# Altium schematic sheet HEATER.SchDoc: HEATER
size 420 x 297 mm; SheetNumber: 7; SheetTotal: 11
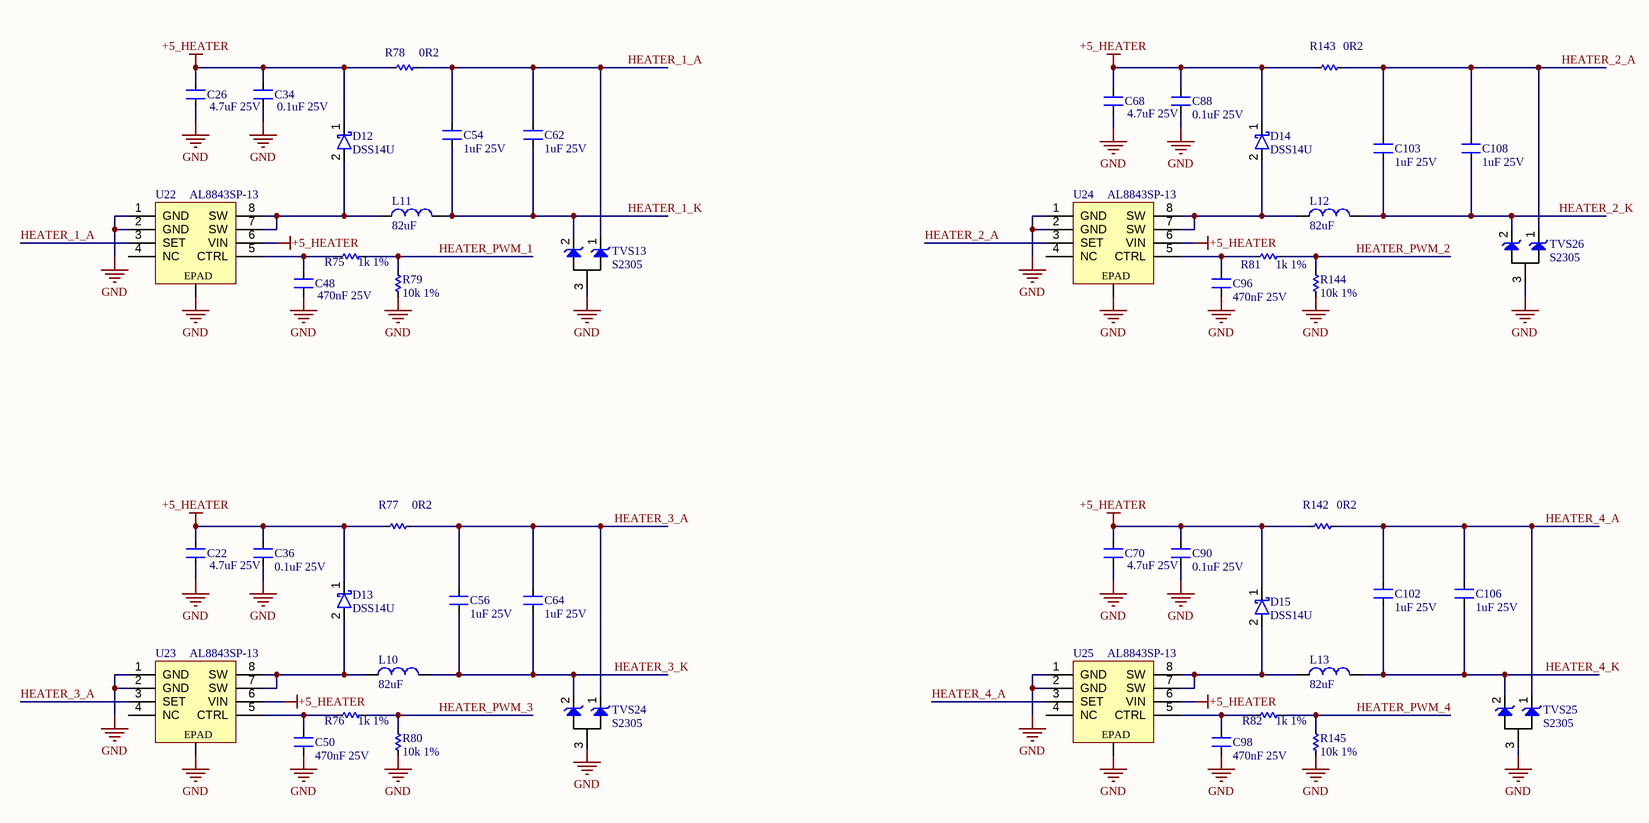
[diagram p0: HEATER.SchDoc]

## Parts
C22  4.7uF 25V  [CN-SMD-0603]
C26  4.7uF 25V  [CN-SMD-0603]
C34  0.1uF 25V  [CN-SMD-0603]
C36  0.1uF 25V  [CN-SMD-0603]
C48  470nF 25V  [CN-SMD-0603]
C50  470nF 25V  [CN-SMD-0603]
C54  1uF 25V  [CN-SMD-0603]
C56  1uF 25V  [CN-SMD-0603]
C62  1uF 25V  [CN-SMD-0603]
C64  1uF 25V  [CN-SMD-0603]
C68  4.7uF 25V  [CN-SMD-0603]
C70  4.7uF 25V  [CN-SMD-0603]
C88  0.1uF 25V  [CN-SMD-0603]
C90  0.1uF 25V  [CN-SMD-0603]
C96  470nF 25V  [CN-SMD-0603]
C98  470nF 25V  [CN-SMD-0603]
C102  1uF 25V  [CN-SMD-0603]
C103  1uF 25V  [CN-SMD-0603]
C106  1uF 25V  [CN-SMD-0603]
C108  1uF 25V  [CN-SMD-0603]
D12  DSS14U  [sod-123]
D13  DSS14U  [sod-123]
D14  DSS14U  [sod-123]
D15  DSS14U  [sod-123]
L10  82uF  [L-SMD-M-4.8x4.8x2.8mm]
L11  82uF  [L-SMD-M-4.8x4.8x2.8mm]
L12  82uF  [L-SMD-M-4.8x4.8x2.8mm]
L13  82uF  [L-SMD-M-4.8x4.8x2.8mm]
R75  1k 1%  [RES-SMD-0603]
R76  1k 1%  [RES-SMD-0603]
R77  0R2  [RES-SMD-1206]
R78  0R2  [RES-SMD-1206]
R79  10k 1%  [RES-SMD-0603]
R80  10k 1%  [RES-SMD-0603]
R81  1k 1%  [RES-SMD-0603]
R82  1k 1%  [RES-SMD-0603]
R142  0R2  [RES-SMD-1206]
R143  0R2  [RES-SMD-1206]
R144  10k 1%  [RES-SMD-0603]
R145  10k 1%  [RES-SMD-0603]
TVS13  S2305  [sot23-12_3]
TVS24  S2305  [sot23-12_3]
TVS25  S2305  [sot23-12_3]
TVS26  S2305  [sot23-12_3]
U22  AL8843SP-13  [SO8_EPAD]
U23  AL8843SP-13  [SO8_EPAD]
U24  AL8843SP-13  [SO8_EPAD]
U25  AL8843SP-13  [SO8_EPAD]

## Nets
+5_HEATER: C22.2 C26.2 C34.2 C36.2 C68.2 C70.2 C88.2 C90.2 D12.1 D13.1 D14.1 D15.1 R77.2 R78.2 R142.2 R143.2 U22.6(VIN) U23.6(VIN) U24.6(VIN) U25.6(VIN)
GND: C22.1 C26.1 C34.1 C36.1 C48.1 C50.1 C68.1 C70.1 C88.1 C90.1 C96.1 C98.1 R79.1 R80.1 R144.1 R145.1 TVS13.3 TVS24.3 TVS25.3 TVS26.3 U22.1(GND) U22.2(GND) U22.EPAD U23.1(GND) U23.2(GND) U23.EPAD U24.1(GND) U24.2(GND) U24.EPAD U25.1(GND) U25.2(GND) U25.EPAD
HEATER_1_A: C54.2 C62.2 R78.1 TVS13.1 U22.3(SET)
HEATER_1_K: C54.1 C62.1 L11.2 TVS13.2
HEATER_2_A: C103.2 C108.2 R143.1 TVS26.1 U24.3(SET)
HEATER_2_K: C103.1 C108.1 L12.2 TVS26.2
HEATER_3_A: C56.2 C64.2 R77.1 TVS24.1 U23.3(SET)
HEATER_3_K: C56.1 C64.1 L10.2 TVS24.2
HEATER_4_A: C102.2 C106.2 R142.1 TVS25.1 U25.3(SET)
HEATER_4_K: C102.1 C106.1 L13.2 TVS25.2
HEATER_PWM_1: R75.2 R79.2
HEATER_PWM_2: R81.2 R144.2
HEATER_PWM_3: R76.2 R80.2
HEATER_PWM_4: R82.2 R145.2
NetC48_2: C48.2 R75.1 U22.5(CTRL)
NetC50_2: C50.2 R76.1 U23.5(CTRL)
NetC96_2: C96.2 R81.1 U24.5(CTRL)
NetC98_2: C98.2 R82.1 U25.5(CTRL)
NetD12_2: D12.2 L11.1 U22.7(SW) U22.8(SW)
NetD13_2: D13.2 L10.1 U23.7(SW) U23.8(SW)
NetD14_2: D14.2 L12.1 U24.7(SW) U24.8(SW)
NetD15_2: D15.2 L13.1 U25.7(SW) U25.8(SW)

Not connected (* = marked no-connect by the designer): U22 4(NC); U23 4(NC); U24 4(NC); U25 4(NC)

## Notes on the sheet
- Project:
- BEE-PC1
- Sub-system:
- NANORACK_EXP_CONTROLLER
- Design by:
- SANG HUYNH
- BAO BUI Q.
- Sheet title:
- Sheet
- A3
- of
- Checked by:
- Approved by:
- VU PHAM
- Revision:
- Document No:
- V1.0.0
- Size:
- Date:
- 01/10/2024

## Library data of the parts
C22 C26 C34 C36 C48 C50 C54 C56 C62 C64 C68 C70 C88 C90 C96 C98 C102 C103 C106 C108 = Capacitors: Value: 33pF
L10-L13 = L-SMD-1: FIXED IND 82UH 2.25A 160MOHM SMD / PN: 744770182; partNo: 78477010; Manufacturer: Wurth Elektronik; Inductance: 1.0 μH; ComponentLink1Description: Manufacturer; ComponentLink1URL: http://www.we-online.de; Created by: Baojun Chen; Created Date: Nov.2015; ComponentLink2Description: Datasheet; ComponentLink2URL: http://katalog.we-online.de/pbs/datasheet/78477010.pdf
R75 R76 R79-R82 R144 R145 = Res SMD: SMD; Manufacturer: Generic Components; Class: Passive; Published: 08/06/2000; Publisher: Altium Hobart Technology Centre
R77 R78 R142 R143 = Res-SMD: RES 0.1 OHM 1% 1W 1206 / PN: PE1206FRF470R1L; Manufacturer: Generic Components; Class: Passive; Published: 08/06/2000; Publisher: Altium Hobart Technology Centre
TVS13 TVS24-TVS26 = S2305: TVS DIODE 5VWM 10.8VC SOT23
U22-U25 = AL8843SP-13: IC LED DRIVER RGLTR PWM 3A 8SO